# Altium schematic sheet lan_board.SchDoc
size A4
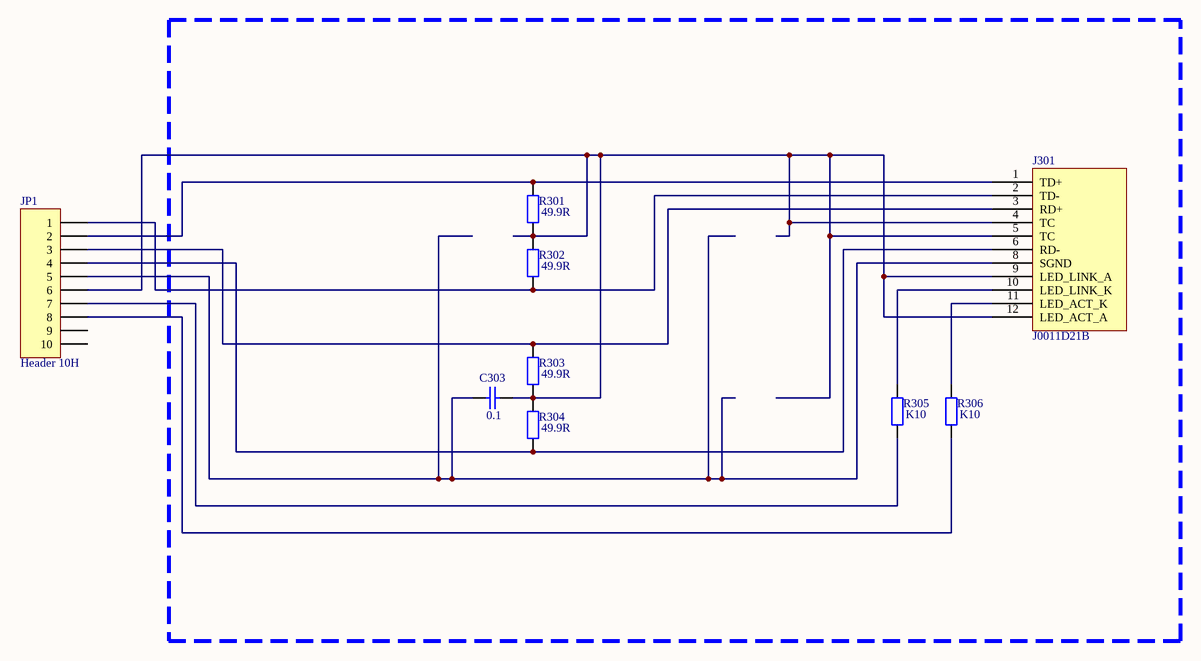
[diagram p0: lan_board.SchDoc]

## Parts
C303  0.1  [C3216-1206]
J301  J0011D21B  [J0011D21B]
JP1  Header 10H  [HDR2X5]
R301  49.9R  [_1206]
R302  49.9R  [_1206]
R303  49.9R  [_1206]
R304  49.9R  [_1206]
R305  K10  [_1206]
R306  K10  [_1206]

## Nets
NetC303_1: C303.1 J301.8(SGND) JP1.5
NetC303_2: C303.2 J301.4(TC) J301.5(TC) J301.9(LED_LINK_A) J301.12(LED_ACT_A) JP1.6 R301.2 R302.1 R303.2 R304.1
NetJ301_1: J301.1(TD+) JP1.2 R301.1
NetJ301_2: J301.2(TD-) JP1.1 R302.2
NetJ301_3: J301.3(RD+) JP1.3 R303.1
NetJ301_6: J301.6(RD-) JP1.4 R304.2
NetJ301_10: J301.10(LED_LINK_K) R305.1
NetJ301_11: J301.11(LED_ACT_K) R306.1
NetJP1_7: JP1.7 R305.2
NetJP1_8: JP1.8 R306.2

Not connected (* = marked no-connect by the designer): JP1 9 10

## Library data of the parts
C303 = Cap Semi: Capacitor (Semiconductor SIM Model); Manufacturer: Generic Components; Class I: Passive; Value: 1,0; Published: 8-Jun-2000; Revision: July-2002: Re-released for DXP Platform.; Publisher: Altium Limited; Class II: Capacitor
JP1 = Header 10H: Header, 10-Pin, Right Angle; Manufacturer: Generic Components; Class I: Connector; Revision: July-2002: Re-released for DXP Platform.; Publisher: Altium Limited
R301-R306 = Res2: Resistor; Manufacturer: Generic Components; Class I: Passive; Value: 30; Rule: Undefined; Published: 8-Jun-2000; Revision: July-2002: Re-released for DXP Platform.; Publisher: Altium Limited; Class II: Resistor